# EasyEDA schematic SCH_battery_controller_2026-03-11.json
TITLE: Sheet_1; REV: 1.0; Date: 2026-03-08; Sheet: 1/1; Drawn By: arek.stasko; Company: Your Company
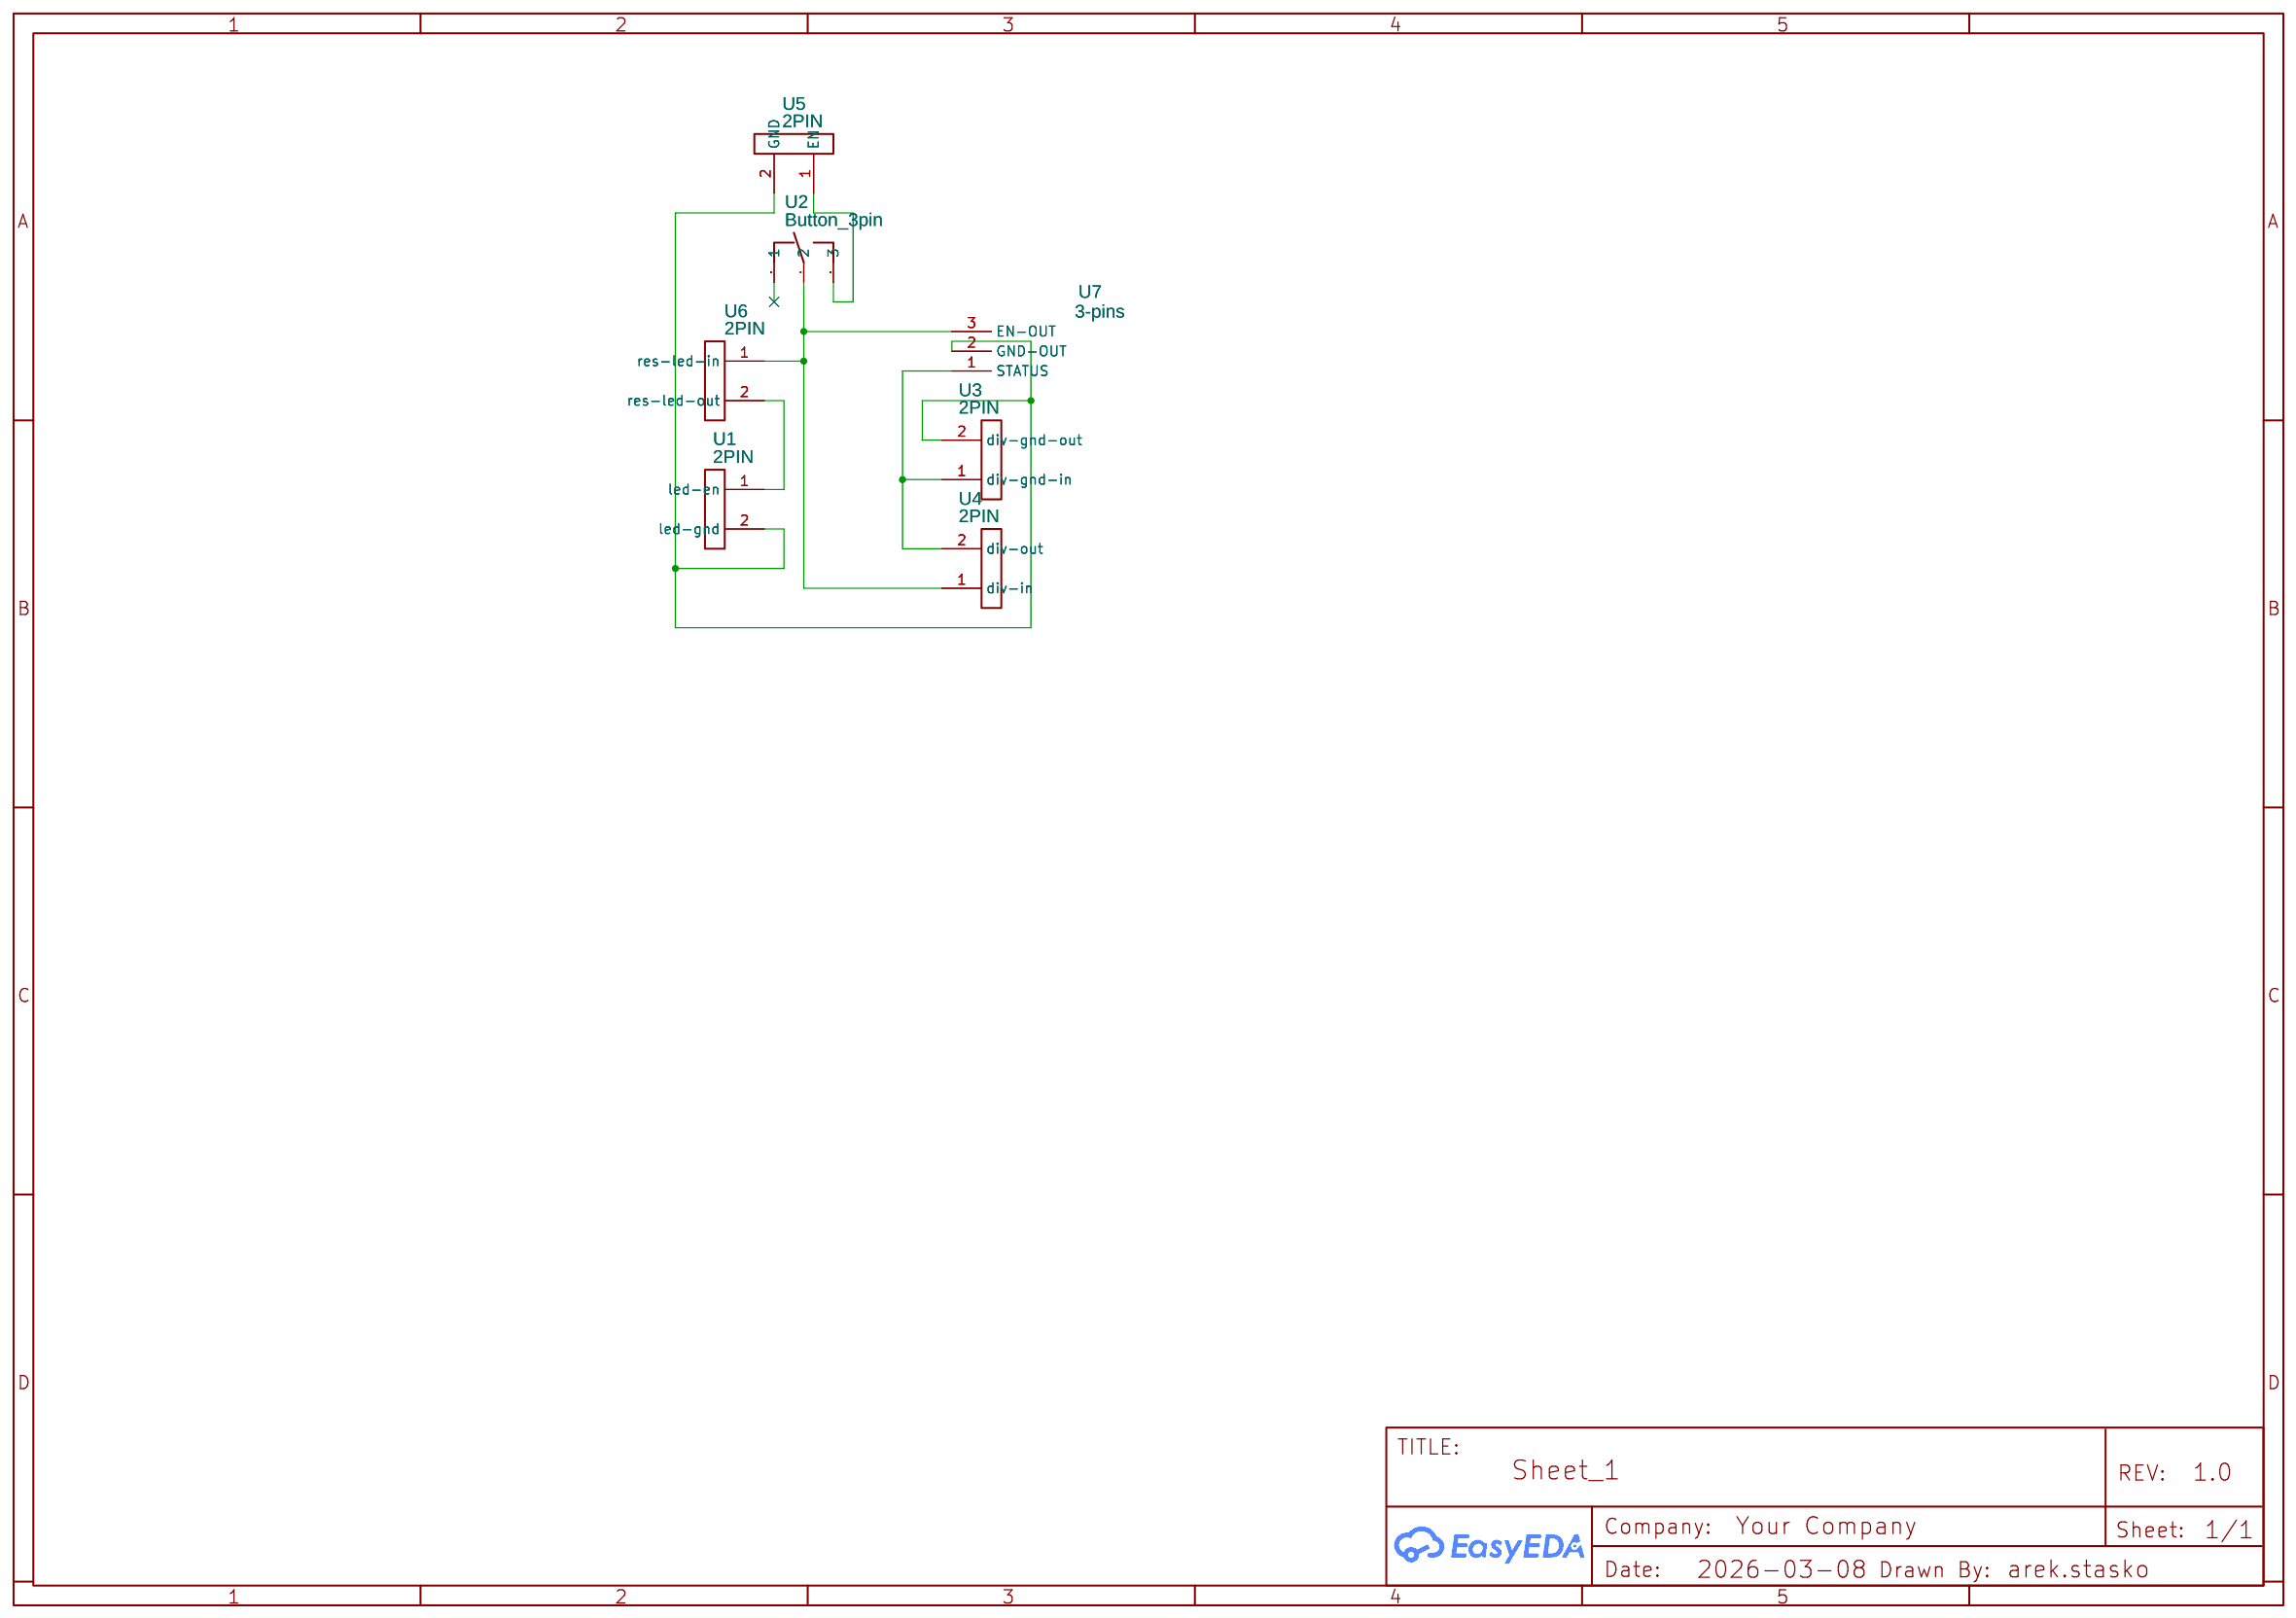
[diagram p0: schematic sheet]

## Parts
U1  2PIN  [2PIN]
U2  Button_3pin  [BUTTON_3PIN]
U3  2PIN  [2PIN]
U4  2PIN  [2PIN]
U5  2PIN  [2PIN]
U6  2PIN  [2PIN]
U7  3-pins  [3-PINS]

## Library data of the parts
U1 U3-U6 = 2PIN: Contributor: SeanAU
U2 = Button_3pin: Contributor: wyder
U7 = 3-pins: Contributor: lrkulak

## Nets
Net-(U1-1): U1.1(led-en) U6.2(res-led-out)
Net-(U1-2): U1.2(led-gnd) U3.2(div-gnd-out) U5.2(GND) U7.2(GND-OUT)
Net-(U2-2): U2.2 U4.1(div-in) U6.1(res-led-in) U7.3(EN-OUT)
Net-(U2-3): U2.3 U5.1(EN)
Net-(U3-1): U3.1(div-gnd-in) U4.2(div-out) U7.1(STATUS)

Not connected (* = marked no-connect by the designer): U2 1
